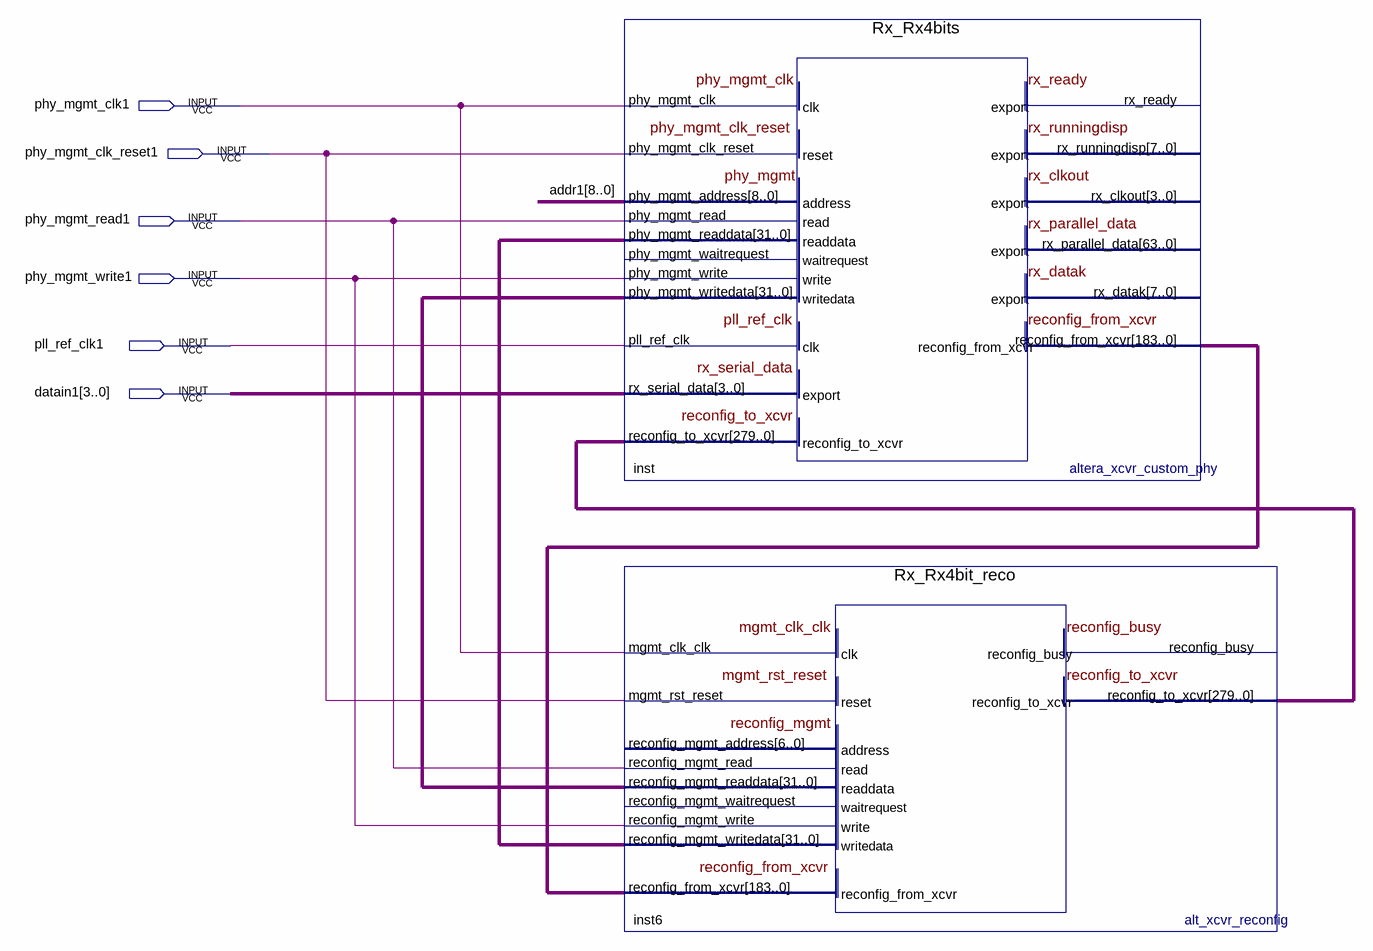
[diagram p0: schematic sheet]
// Quartus schematic Block2.bdf as structural Verilog: 2 symbols, 6 pins
module Block2 (
  input  phy_mgmt_clk1,
  input  phy_mgmt_clk_reset1,
  input  phy_mgmt_read1,
  input  phy_mgmt_write1,
  input  pll_ref_clk1,
  input  [3:0] datain1
);

  wire [8:0] addr1;
  wire [31:0] inst6_reconfig_mgmt_readdata, inst_phy_mgmt_readdata;
  wire [183:0] inst_reconfig_from_xcvr;
  wire [279:0] inst6_reconfig_to_xcvr;

  Rx_Rx4bits inst (
    .phy_mgmt_clk(phy_mgmt_clk1), .phy_mgmt_clk_reset(phy_mgmt_clk_reset1), .phy_mgmt_address(addr1),
    .phy_mgmt_read(phy_mgmt_read1), .phy_mgmt_write(phy_mgmt_write1),
    .phy_mgmt_writedata(inst6_reconfig_mgmt_readdata), .pll_ref_clk(pll_ref_clk1), .rx_serial_data(datain1),
    .reconfig_to_xcvr(inst6_reconfig_to_xcvr), .phy_mgmt_readdata(inst_phy_mgmt_readdata),
    .reconfig_from_xcvr(inst_reconfig_from_xcvr));  // open: phy_mgmt_waitrequest, rx_ready, rx_runningdisp, rx_clkout, rx_parallel_data, rx_datak
  Rx_Rx4bit_reco inst6 (
    .mgmt_clk_clk(phy_mgmt_clk1), .mgmt_rst_reset(phy_mgmt_clk_reset1), .reconfig_mgmt_read(phy_mgmt_read1),
    .reconfig_mgmt_write(phy_mgmt_write1), .reconfig_mgmt_writedata(inst_phy_mgmt_readdata),
    .reconfig_from_xcvr(inst_reconfig_from_xcvr), .reconfig_mgmt_readdata(inst6_reconfig_mgmt_readdata),
    .reconfig_to_xcvr(inst6_reconfig_to_xcvr));  // open: reconfig_mgmt_address, reconfig_busy, reconfig_mgmt_waitrequest
endmodule
